# EAGLE design Imager Mainboard (EAGLE 7.7.0)
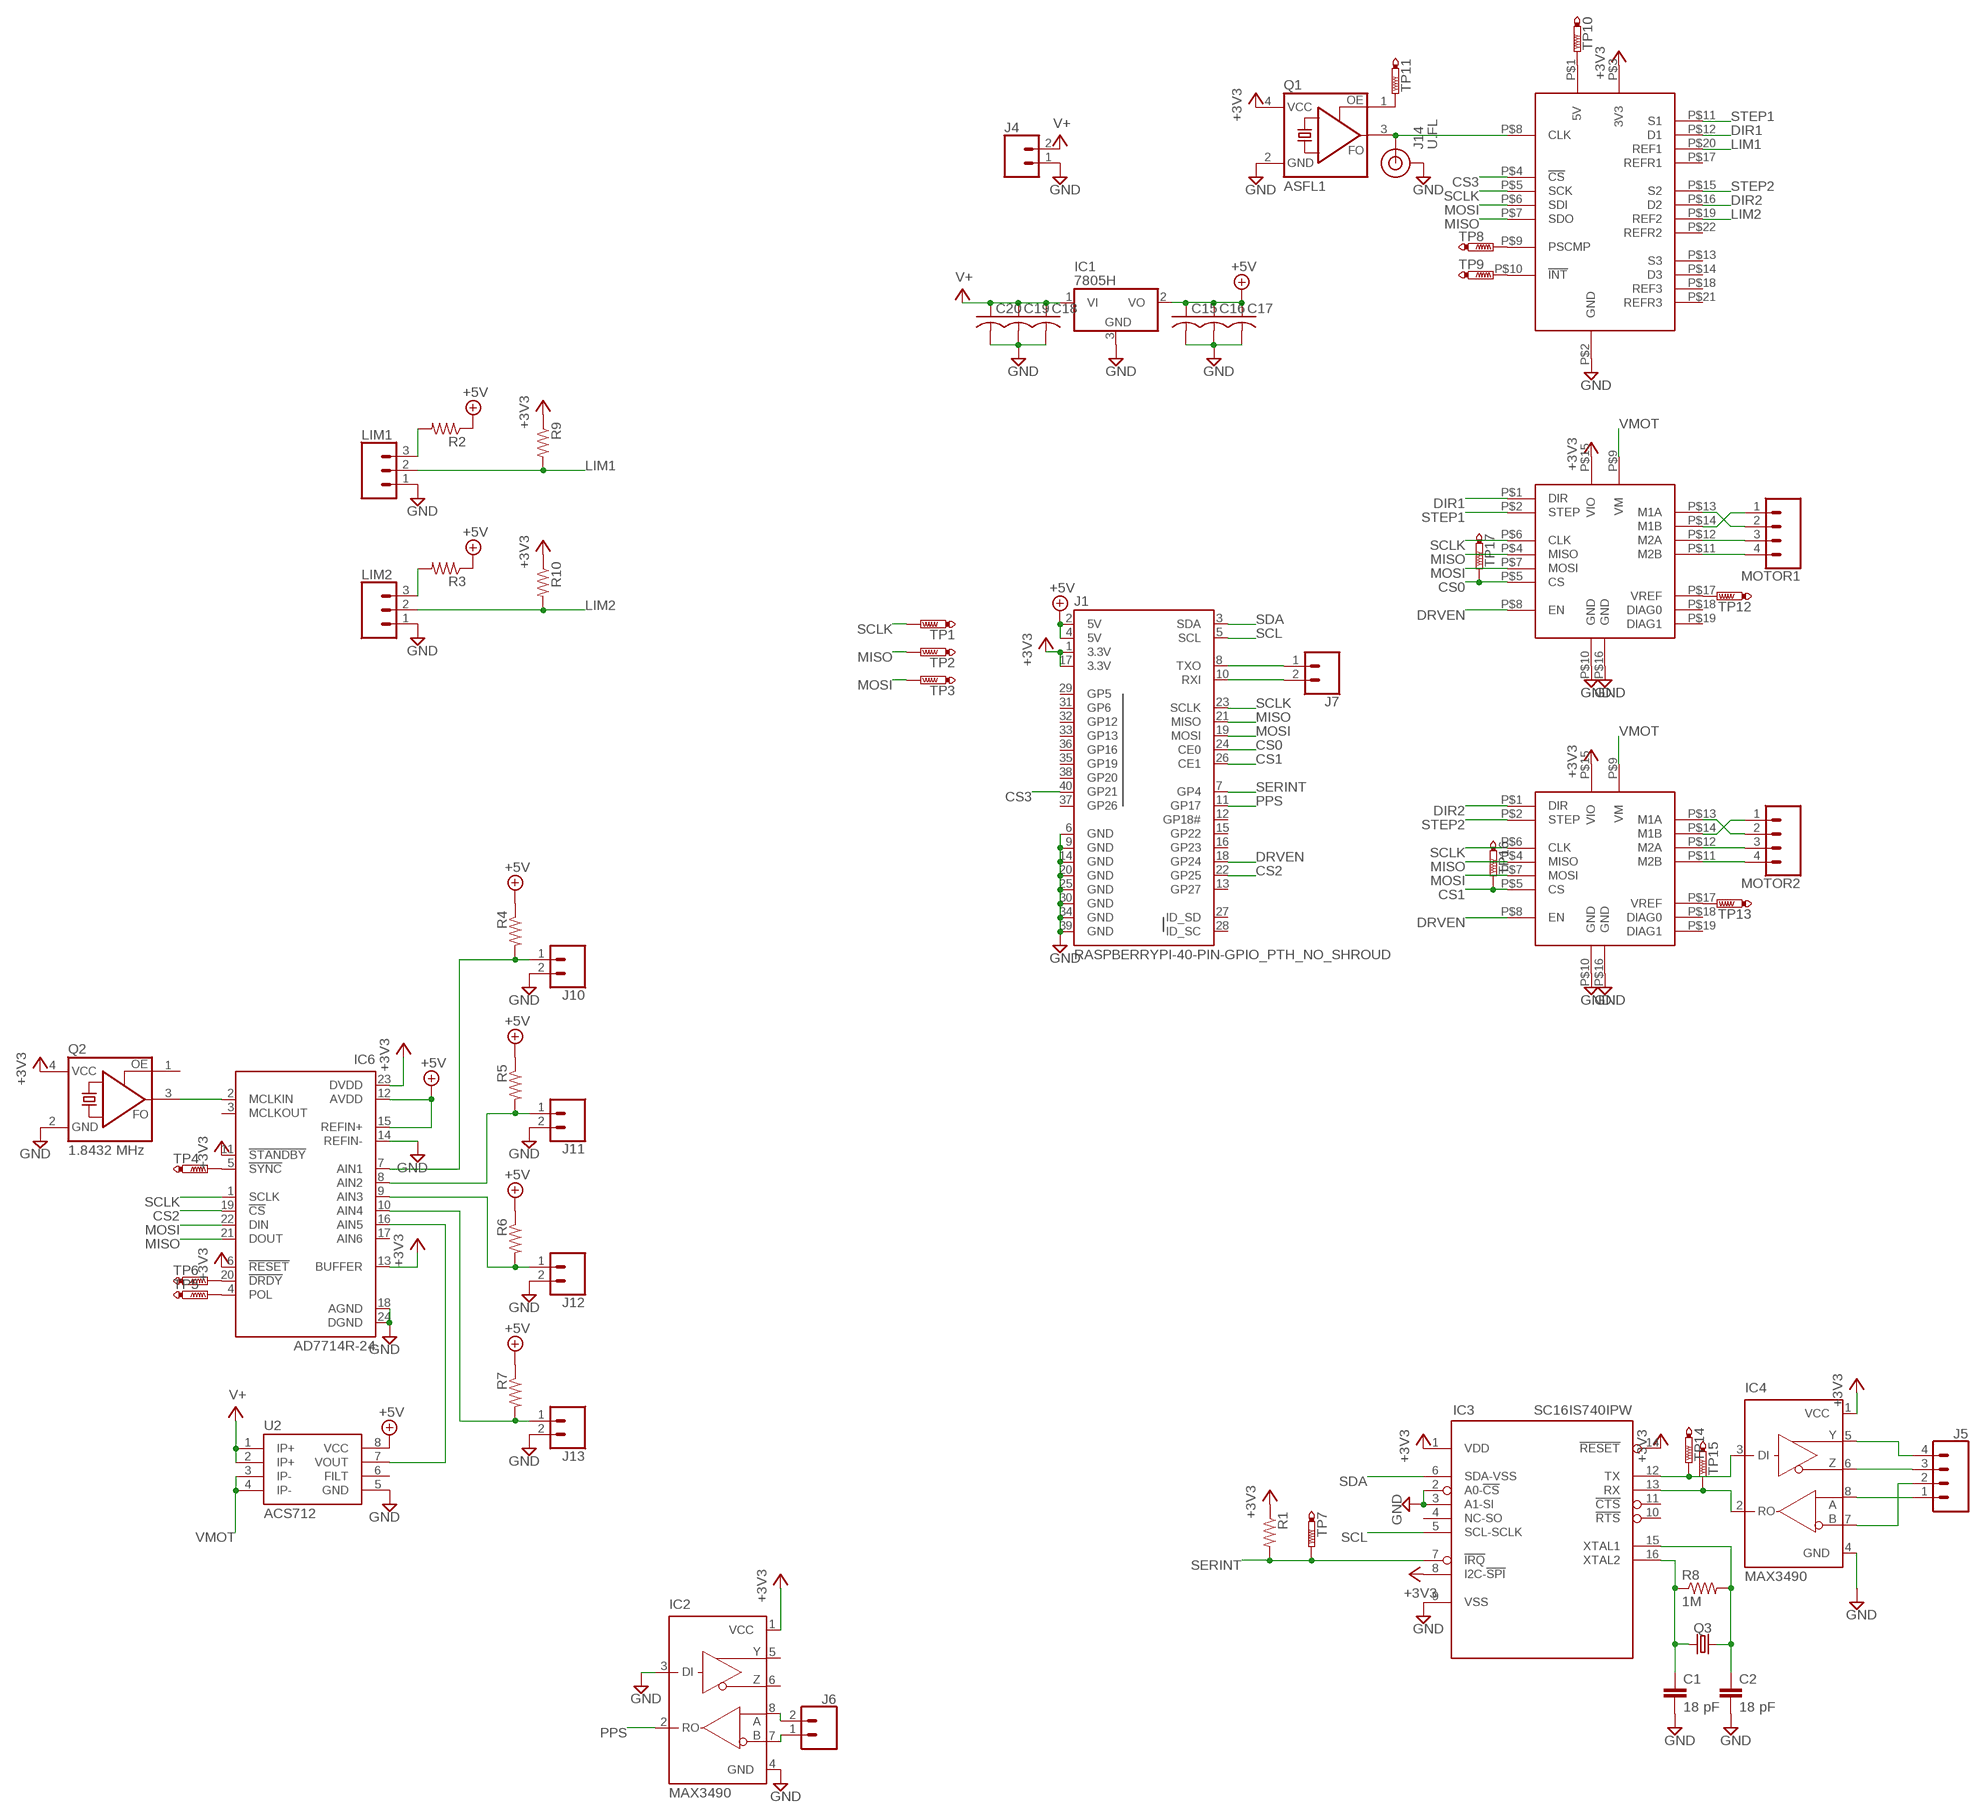
[diagram p0: schematic, sheet 1]

## Parts
C1  18 pF  C-EUC1206  [C1206]
C2  18 pF  C-EUC1206  [C1206]
C15  C-USC1206  [C1206]
C16  C-USC1206  [C1206]
C17  C-USC1206  [C1206]
C18  C-USC1206  [C1206]
C19  C-USC1206  [C1206]
C20  C-USC1206  [C1206]
DRV1  SILENTSTEPSTICK  [SILENTSTEPSTICK]
DRV2  SILENTSTEPSTICK  [SILENTSTEPSTICK]
IC1  7805H  [TO39]
IC2  MAX3490  MAX3467CPA  [SO08]
IC3  SC16IS740IPW  [TSSOP16L]
IC4  MAX3490  MAX3467CPA  [SO08]
IC6  AD7714R-24  [SO24R]
J1  RASPBERRYPI-40-PIN-GPIO_PTH_NO_SHROUD  [2X20]
J4  CONN_02  [1X02]
J5  CONN_04  [1X04]
J6  CONN_02  [1X02]
J7  CONN_02  [1X02]
J10  CONN_02  [1X02]
J11  CONN_02  [1X02]
J12  CONN_02  [1X02]
J13  CONN_02  [1X02]
J14  U.FL  U.FL2PIN  [U.FL]
LIM1  CONN_03  [1X03]
LIM2  CONN_03  [1X03]
MOTOR1  CONN_04  [1X04]
MOTOR2  CONN_04  [1X04]
Q1  ASFL1  [ASF]
Q2  1.8432 MHz  ASFL1  [ASF]
Q3  CRYSTALSMD-5X3.2-4PAD  [CRYSTAL-SMD-5X3.2-4PAD]
R1  R-US_R1206  [R1206]
R2  R-US_R1206  [R1206]
R3  R-US_R1206  [R1206]
R4  R-US_R1206  [R1206]
R5  R-US_R1206  [R1206]
R6  R-US_R1206  [R1206]
R7  R-US_R1206  [R1206]
R8  1M  R-US_R1206  [R1206]
R9  R-US_R1206  [R1206]
R10  R-US_R1206  [R1206]
TP1  PTR1PAD1-13  [P1-13]
TP2  PTR1PAD1-13  [P1-13]
TP3  PTR1PAD1-13  [P1-13]
TP4  PTR1B1,27  [B1,27]
TP5  PTR1B1,27  [B1,27]
TP6  PTR1B1,27  [B1,27]
TP7  PTR1B1,27  [B1,27]
TP8  PTR1PAD1-13  [P1-13]
TP9  PTR1PAD1-13  [P1-13]
TP10  PTR1PAD1-13  [P1-13]
TP11  PTR1PAD1-13  [P1-13]
TP12  PTR1PAD1-13  [P1-13]
TP13  PTR1PAD1-13  [P1-13]
TP14  PTR1PAD1-13  [P1-13]
TP15  PTR1PAD1-13  [P1-13]
TP16  PTR1PAD1-13  [P1-13]
TP17  PTR1PAD1-13  [P1-13]
U2  ACS712  [SO08]
U$1  TMC429-BOB  [TMC429-BOB]

## Nets
+3V3: DRV1.P$15(VIO) DRV2.P$15(VIO) IC2.1(VCC) IC3.1(VDD) IC3.8(I2C-!SPI) IC3.14(!RESET) IC4.1(VCC) IC6.6(!RESET) IC6.11(!STANDBY) IC6.13(BUFFER) IC6.23(DVDD) J1.1(3.3V) J1.17(3.3V) Q1.4(VCC) Q2.4(VCC) R1.1 R9.1 R10.1 U$1.P$3(3V3)
+5V: C15.1 C16.1 C17.1 IC1.2(VO) IC6.12(AVDD) IC6.15(REFIN+) J1.2(5V) J1.4(5V) R2.1 R3.1 R4.1 R5.1 R6.1 R7.1 U2.8(VCC)
CS0: DRV1.P$5(CS) J1.24(CE0) TP17.TP
CS1: DRV2.P$5(CS) J1.26(CE1) TP16.TP
CS2: IC6.19(!CS) J1.22(GP25)
CS3: J1.40(GP21) U$1.P$4(!CS)
DIR1: DRV1.P$1(DIR) U$1.P$12(D1)
DIR2: DRV2.P$1(DIR) U$1.P$16(D2)
DRVEN: DRV1.P$8(EN) DRV2.P$8(EN) J1.18(GP24)
GND: C1.2 C2.2 C15.2 C16.2 C17.2 C18.2 C19.2 C20.2 DRV1.P$10(GND) DRV1.P$16(GND) DRV2.P$10(GND) DRV2.P$16(GND) IC1.3(GND) IC2.3(DI) IC2.4(GND) IC3.2(A0-!CS) IC3.3(A1-SI) IC3.9(VSS) IC4.4(GND) IC6.14(REFIN-) IC6.18(AGND) IC6.24(DGND) J1.6(GND) J1.9(GND) J1.14(GND) J1.20(GND) J1.25(GND) J1.30(GND) J1.34(GND) J1.39(GND) J4.1 J10.2 J11.2 J12.2 J13.2 J14.1(GND) J14.2(GND) LIM1.1 LIM2.1 Q1.2(GND) Q2.2(GND) U2.5(GND) U$1.P$2(GND)
LIM1: LIM1.2 R9.2 U$1.P$20(REF1)
LIM2: LIM2.2 R10.2 U$1.P$19(REF2)
MISO: DRV1.P$4(MISO) DRV2.P$4(MISO) IC6.21(DOUT) J1.21(MISO) TP2.TP U$1.P$7(SDO)
MOSI: DRV1.P$7(MOSI) DRV2.P$7(MOSI) IC6.22(DIN) J1.19(MOSI) TP3.TP U$1.P$6(SDI)
N$1: DRV2.P$14(M1B) MOTOR2.1
N$2: DRV2.P$13(M1A) MOTOR2.2
N$3: IC3.12(TX) IC4.3(DI) TP14.TP
N$4: DRV2.P$12(M2A) MOTOR2.3
N$5: DRV2.P$11(M2B) MOTOR2.4
N$6: DRV1.P$14(M1B) MOTOR1.1
N$7: DRV1.P$13(M1A) MOTOR1.2
N$8: DRV1.P$12(M2A) MOTOR1.3
N$9: DRV1.P$11(M2B) MOTOR1.4
N$10: J1.8(TXO) J7.1
N$11: J1.10(RXI) J7.2
N$12: IC6.2(MCLKIN) Q2.3(FO)
N$13: IC6.5(!SYNC) TP4.TP
N$14: LIM1.3 R2.2
N$15: J14.FEED(SIGNAL) Q1.3(FO) U$1.P$8(CLK)
N$16: LIM2.3 R3.2
N$17: IC6.4(POL) TP5.TP
N$18: IC6.16(AIN5) U2.7(VOUT)
N$19: IC6.20(!DRDY) TP6.TP
N$20: IC6.7(AIN1) J10.1 R4.2
N$21: TP8.TP U$1.P$9(PSCMP)
N$22: IC6.8(AIN2) J11.1 R5.2
N$23: IC6.9(AIN3) J12.1 R6.2
N$24: IC6.10(AIN4) J13.1 R7.2
N$25: TP9.TP U$1.P$10(!INT)
N$26: TP10.TP U$1.P$1(5V)
N$27: Q1.1(OE) TP11.TP
N$28: DRV1.P$17(VREF) TP12.TP
N$29: DRV2.P$17(VREF) TP13.TP
N$30: C2.1 IC3.15(XTAL1) Q3.3 R8.2
N$31: C1.1 IC3.16(XTAL2) Q3.1 R8.1
N$37: IC3.13(RX) IC4.2(RO) TP15.TP
N$38: IC4.6(Z) J5.3
N$39: IC4.8(A) J5.1
N$40: IC4.7(B) J5.2
N$41: IC4.5(Y) J5.4
N$43: IC2.7(B) J6.1
N$44: IC2.8(A) J6.2
PPS: IC2.2(RO) J1.11(GP17)
SCL: IC3.5(SCL-SCLK) J1.5(SCL)
SCLK: DRV1.P$6(CLK) DRV2.P$6(CLK) IC6.1(SCLK) J1.23(SCLK) TP1.TP U$1.P$5(SCK)
SDA: IC3.6(SDA-VSS) J1.3(SDA)
SERINT: IC3.7(!IRQ) J1.7(GP4) R1.2 TP7.TP
STEP1: DRV1.P$2(STEP) U$1.P$11(S1)
STEP2: DRV2.P$2(STEP) U$1.P$15(S2)
V+: C18.1 C19.1 C20.1 IC1.1(VI) J4.2 U2.1(IP+) U2.2(IP+)
VMOT: DRV1.P$9(VM) DRV2.P$9(VM) U2.3(IP-) U2.4(IP-)
Unconnected: DRV1.P$18(DIAG0) DRV1.P$19(DIAG1) DRV2.P$18(DIAG0) DRV2.P$19(DIAG1) IC2.5(Y) IC2.6(Z) IC3.4(NC-SO) IC3.10(!RTS) IC3.11(!CTS) IC6.3(MCLKOUT) IC6.17(AIN6) J1.12(GP18#) J1.13(GP27) J1.15(GP22) J1.16(GP23) J1.27(ID_SD) J1.28(ID_SC) J1.29(GP5) J1.31(GP6) J1.32(GP12) J1.33(GP13) J1.35(GP19) J1.36(GP16) J1.37(GP26) J1.38(GP20) Q2.1(OE) U2.6(FILT) U$1.P$13(S3) U$1.P$14(D3) U$1.P$17(REFR1) U$1.P$18(REF3) U$1.P$21(REFR3) U$1.P$22(REFR2)

## Library data of the parts
C1 C2 = resistor:C-EU: CAPACITOR, European symbol
C15-C20 = resistor:C-US: CAPACITOR, American symbol
DRV1 DRV2 = FRC696:SILENTSTEPSTICK
IC1 = linear:78*: Positive VOLTAGE REGULATOR Source: http://cache.national.com/ds/LM/LM78L05.pdf http://www.fairchildsemi.com/ds/LM/LM7805.pdf
IC2 IC4 = maxim:MAX3467*: +5V, Fail-Safe, 40Mbps, Profibus RS-485/RS-422 Transceivers Source: MAX3465-MAX3469.pdf; OC_FARNELL: unknown; OC_NEWARK: unknown
IC3 = FRC696:SC16IS740: SPI/I2C/IrDA to UART
IC6 = analog-devices:AD7714: Signal Conditioning ADC 3 V/5 V, CMOS, 500 mA Source: http://www.analog.com/UploadedFiles/Data_Sheets/39677768AD7714_c.pdf; OC_FARNELL: unknown; OC_NEWARK: unknown
J1 = SparkFun-Connectors:RASPBERRYPI-40-PIN-GPIO: Raspberry Pi GPIO Header 2x20 pin connector, as found on B, B+, A+ models. Both shrouded PTH and SMT versions available. SparkFun Products: GPIO Shrouded Header <https://www.sparkfun.com/products/13054>- PTH SparkFun Pi Wedge (Preassembled) <https://www.sparkfun.com/products/13717>
J4 J6 J7 J10-J13 = SparkFun-Connectors:CONN_02: Multi connection point. Often used as Generic Header-pin footprint for 0.1 inch spaced/style header connections On any of the 0.1 inch spaced packages, you can populate with these: Break Away Headers - Straight <https://www.sparkfun.com/products/116> (PRT-00116) Break Away Male Headers - Right Angle <https://www.sparkfun.com/products/553> (PRT-00553) Female Headers <https://www.sparkfun.com/products/115> (PRT-00115) Break Away Headers - Machine Pin <https://www.sparkfun.com/products/117> (PRT-00117) Break Away Female Headers - Swiss Machine Pin <https://www.sparkfun.com/products/743> (PRT-00743) For SCREWTERMINALS and SPRING TERMINALS visit here: Screw Terimnals on SparkFun.com <https://www.sparkfun.com/search/results?term=Screw+Terminals> (5mm/3.5mm/2.54mm spacing) This device is also useful as a general connection point to wire up your design to another part of your project. Our various solder wires solder well into these plated through hole pads. Hook-Up Wire - Assortment (Stranded, 22 AWG) <https://www.sparkfun.com/products/11375> (PRT-11375) Hook-Up Wire - Assortment (Solid Core, 22 AWG) <https://www.sparkfun.com/products/11367> (PRT-11367) View the entire wire category on our website here <https://www.sparkfun.com/categories/141> Special notes: Molex polarized connector foot print use with: PRT-08233 with associated crimp pins and housings. 2.54_SCREWTERM for use with PRT-10571. 3.5mm Screw Terminal footprints for PRT-08084 5mm Screw Terminal footprints for use with PRT-08432
J5 MOTOR1 MOTOR2 = SparkFun-Connectors:CONN_04: Multi connection point. Often used as Generic Header-pin footprint for 0.1 inch spaced/style header connections On any of the 0.1 inch spaced packages, you can populate with these: Break Away Headers - Straight <https://www.sparkfun.com/products/116> (PRT-00116) Break Away Male Headers - Right Angle <https://www.sparkfun.com/products/553> (PRT-00553) Female Headers <https://www.sparkfun.com/products/115> (PRT-00115) Break Away Headers - Machine Pin <https://www.sparkfun.com/products/117> (PRT-00117) Break Away Female Headers - Swiss Machine Pin <https://www.sparkfun.com/products/743> (PRT-00743) For SCREWTERMINALS and SPRING TERMINALS visit here: Screw Terimnals on SparkFun.com <https://www.sparkfun.com/search/results?term=Screw+Terminals> (5mm/3.5mm/2.54mm spacing) This device is also useful as a general connection point to wire up your design to another part of your project. Our various solder wires solder well into these plated through hole pads. Hook-Up Wire - Assortment (Stranded, 22 AWG) <https://www.sparkfun.com/products/11375> (PRT-11375) Hook-Up Wire - Assortment (Solid Core, 22 AWG) <https://www.sparkfun.com/products/11367> (PRT-11367) View the entire wire category on our website here <https://www.sparkfun.com/categories/141> Special notes: Molex polarized connector foot print use with SKU : PRT-08231 with associated crimp pins and housings. 1MM SMD Version SKU: PRT-10208; PROD_ID: CONN-09696
J14 = SparkFun-Connectors:U.FL2PIN: SMD Antenna Connector - U.FL 2mm height, 3.0mm x 3.0mm receptacle size. SparkFun Products: SparkFun WiFi Shield - ESP8266 <https://www.sparkfun.com/products/13287> SparkFun ESP8266 Thing <https://www.sparkfun.com/products/13231> SparkFun MiniGen - Pro Mini Signal Generator Shield <https://www.sparkfun.com/products/11420>; PROD_ID: CONN-09193; SF_ID: WRL-09144
LIM1 LIM2 = SparkFun-Connectors:CONN_03: Multi connection point. Often used as Generic Header-pin footprint for 0.1 inch spaced/style header connections On any of the 0.1 inch spaced packages, you can populate with these: Break Away Headers - Straight <https://www.sparkfun.com/products/116> (PRT-00116) Break Away Male Headers - Right Angle <https://www.sparkfun.com/products/553> (PRT-00553) Female Headers <https://www.sparkfun.com/products/115> (PRT-00115) Break Away Headers - Machine Pin <https://www.sparkfun.com/products/117> (PRT-00117) Break Away Female Headers - Swiss Machine Pin <https://www.sparkfun.com/products/743> (PRT-00743) Stackable Header - 3 Pin (Female, 0.1") <https://www.sparkfun.com/products/13875> (PRT-13875) For SCREWTERMINALS and SPRING TERMINALS visit here: Screw Terimnals on SparkFun.com <https://www.sparkfun.com/search/results?term=Screw+Terminals> (5mm/3.5mm/2.54mm spacing) This device is also useful as a general connection point to wire up your design to another part of your project. Our various solder wires solder well into these plated through hole pads. Hook-Up Wire - Assortment (Stranded, 22 AWG) <https://www.sparkfun.com/products/11375> (PRT-11375) Hook-Up Wire - Assortment (Solid Core, 22 AWG) <https://www.sparkfun.com/products/11367> (PRT-11367) View the entire wire category on our website here <https://www.sparkfun.com/categories/141> Special notes: Molex polarized connector foot print use with SKU : PRT-08232 with associated crimp pins and housings.
Q1 Q2 = crystal:ASF*: CRYSTAL CLOCK OSCILLATORS 5.0 Vdc or 3.3 Vdc - LOW PROFILE ULTRA MINIATURE CERAMIC SURFACE MOUNT Source: http://www.abracon.com/Oscillators/asf1-L-L1.pdf; MF: Abracon Corporation; MPN: ASFL1-125.000MHZ-EC-T; OC_FARNELL: 1838931; OC_NEWARK: 19M1882
Q3 = SparkFun-Clocks:CRYSTAL: Crystals (Generic) These are passive quartz crystals, which can be used as a clock source for a microcontroller. Crystal's are two-terminal devices. They require external "load" capacitors to generate an oscillating signal.
R1-R10 = resistor:R-US_: RESISTOR, American symbol
TP1-TP17 = testpad:PTR1: TEST PIN
U2 = SparkFun-Sensors:ACS712: ACS712 Hall-effect-based isolated linear current sensor Datasheet <http://www.sparkfun.com/datasheets/BreakoutBoards/0712.pdf> SparkFun Products SparkFun Low Current Sensor Breakout - ACS712 <https://www.sparkfun.com/products/8883> (SEN-08883); PROD_ID: IC-08964
U$1 = FRC696:TMC429-BOB

## Board
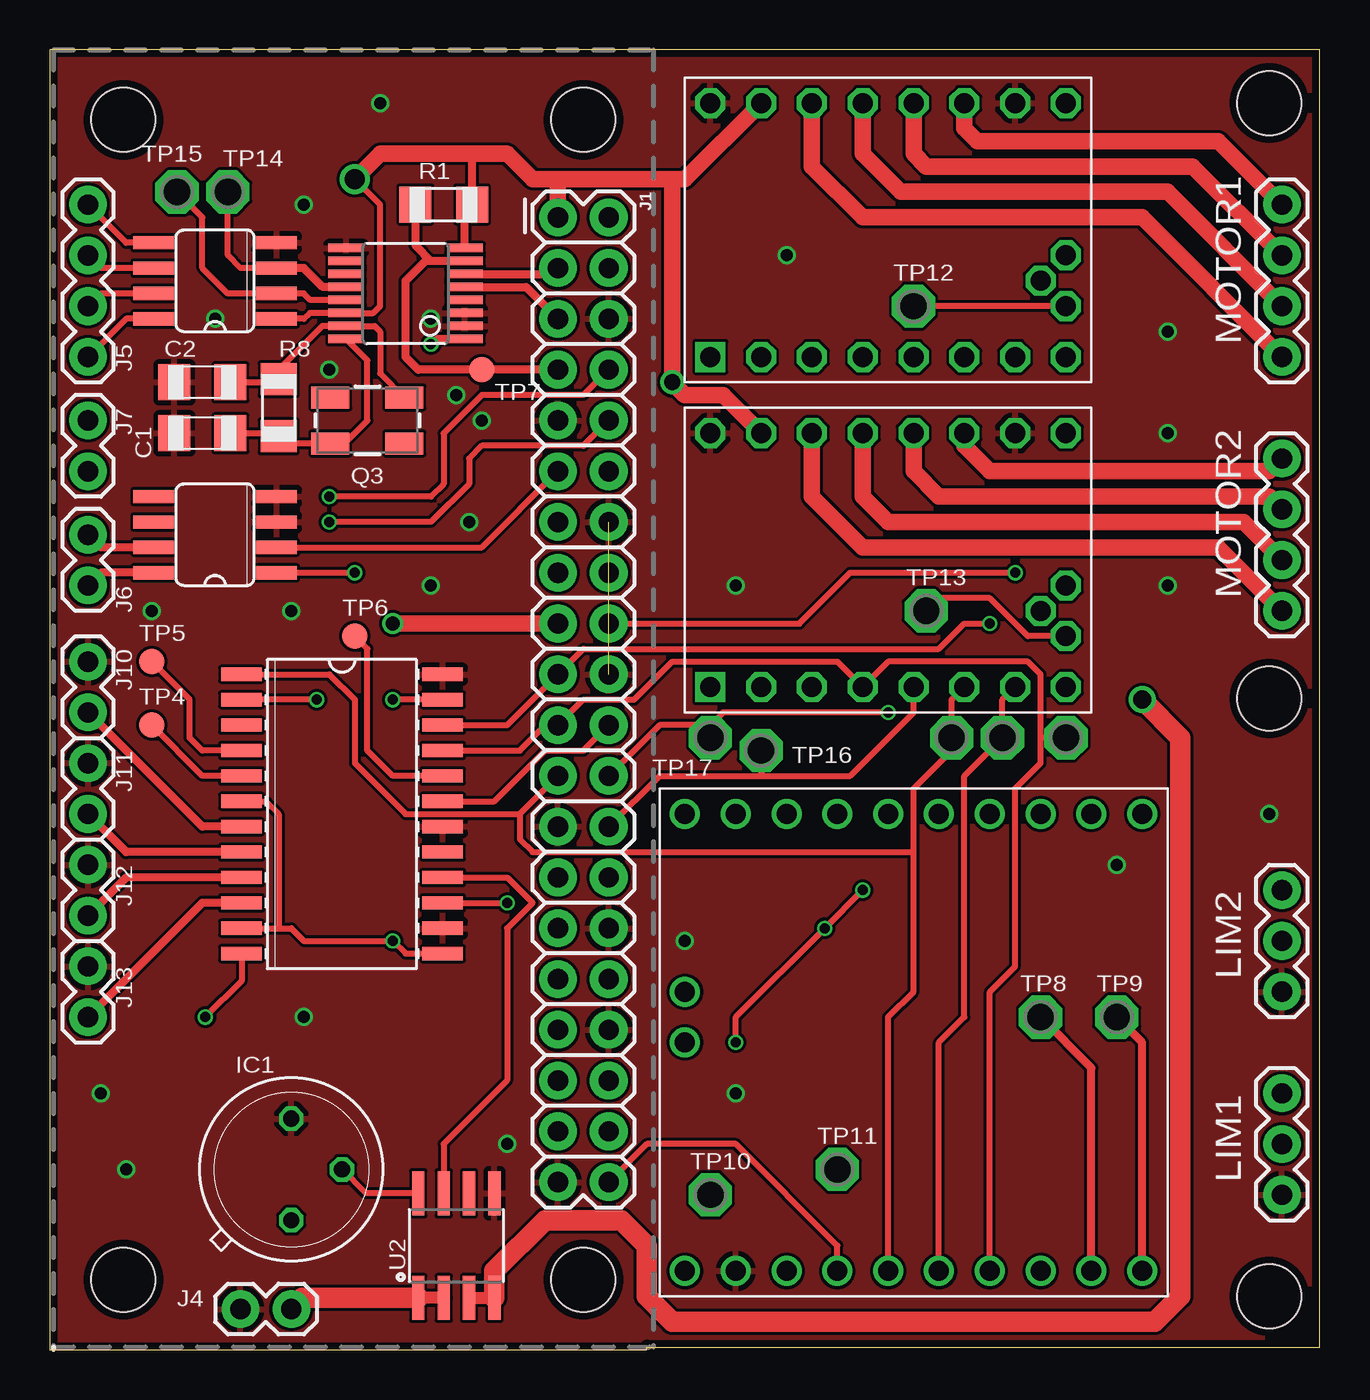
[diagram p1: board, top side]
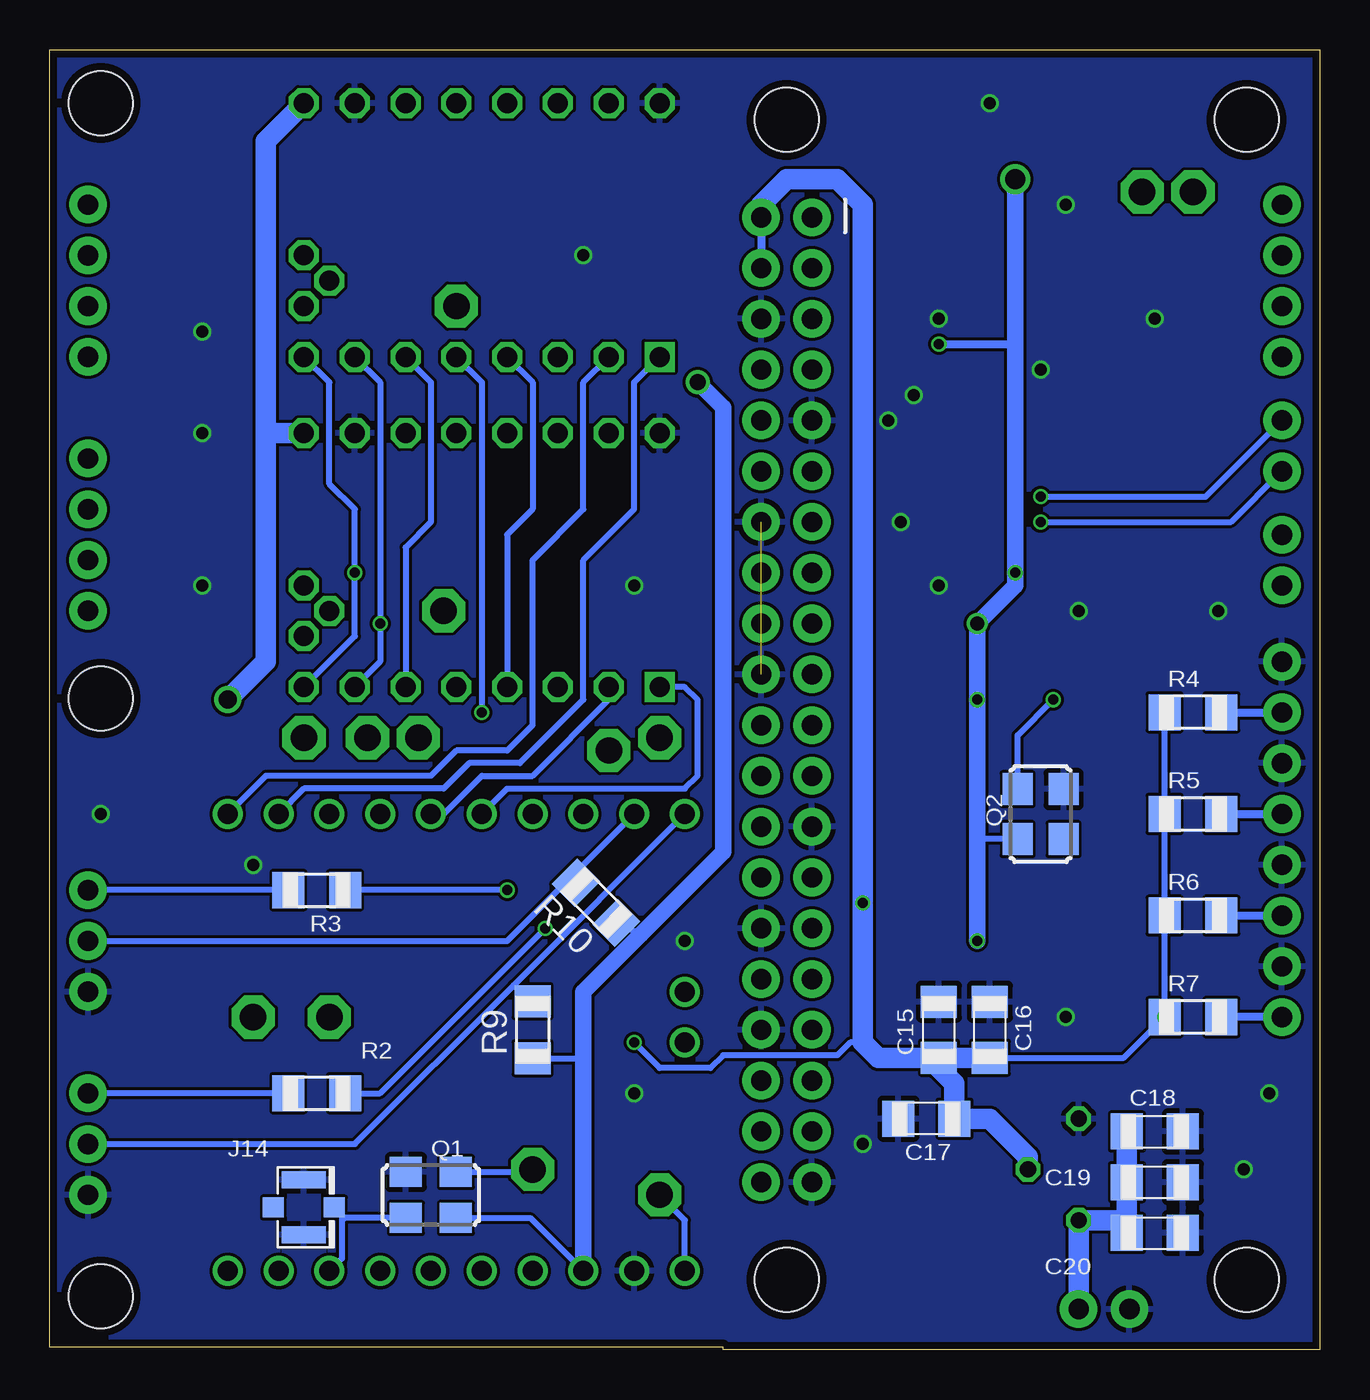
[diagram p2: board, bottom side, seen from below]

Size 63.5 x 65 mm. Coordinates in mm from the lower left corner, seen from the top.
Outline: 0,0 29.84,0 29.84,0.12 63.5,0.12 63.5,65 0,65 0,0
Copper layers (1*16): Top 0.035559375mm / dielectric 1.6mm / Bottom 0.035559375mm
Design rules "oshpark-2layer": minimum track width 6mil, minimum drill 10mil, track to track 6mil, track to pad 6mil, pad to pad 6mil, via to via 6mil, smd to smd 6mil, copper to edge 15mil, drill to drill 6mil, minimum pad ring 5mil, minimum via ring 5mil, stop-mask expansion 2.5mil, vias tented up to drill 0mil, thermal gap 10mil
Holes 3.2 mm at 3.67,61.5 26.67,61.5 26.67,3.5 3.67,3.5 60.96,2.66 60.96,62.35 60.96,32.56

### Footprints (pad centres in the part's own frame; a part is rotated, then mirrored left to right if it is on the bottom)
C1206 = smd 1.6 x 1.8: 1 -1.4,0; 2 1.4,0
SILENTSTEPSTICK = drill 1 square: P$1 -6.35,7.62 | drill 1 octagon: P$2 -6.35,5.08; P$3 -6.35,2.54; P$4 -6.35,0; P$5 -6.35,-2.54; P$6 -6.35,-5.08; P$7 -6.35,-7.62; P$8 -6.35,-10.16; P$9 6.35,-10.16; P$10 6.35,-7.62; P$11 6.35,-5.08; P$12 6.35,-2.54; P$13 6.35,0; P$14 6.35,2.54; P$15 6.35,5.08; P$16 6.35,7.62; P$17 -3.81,-10.16; P$18 -2.54,-8.89; P$19 -1.27,-10.16
TO39 = drill 0.813 octagon: 1 0,-2.54; 2 2.54,0; 3 0,2.54
SO08 = smd 0.66 x 2.032: 1 -1.905,-3.073; 2 -0.635,-3.073; 3 0.635,-3.073; 4 1.905,-3.073; 5 1.905,3.073; 6 0.635,3.073; 7 -0.635,3.073; 8 -1.905,3.073
TSSOP16L = smd 0.42 x 1.78: 1 -2.275,-2.97; 2 -1.625,-2.97; 3 -0.975,-2.97; 4 -0.325,-2.97; 5 0.325,-2.97; 6 0.975,-2.97; 7 1.625,-2.97; 8 2.275,-2.97; 9 2.275,2.97; 10 1.625,2.97; 11 0.975,2.97; 12 0.325,2.97; 13 -0.325,2.97; 14 -0.975,2.97; 15 -1.625,2.97; 16 -2.275,2.97
SO24R = smd 0.66 x 2.032: 1 -6.985,-5.029; 2 -5.715,-5.029; 3 -4.445,-5.029; 4 -3.175,-5.029; 5 -1.905,-5.029; 6 -0.635,-5.029; 7 0.635,-5.029; 8 1.905,-5.029; 9 3.175,-5.029; 10 4.445,-5.029; 11 5.715,-5.029; 12 6.985,-5.029; 13 6.985,5.029; 14 5.715,5.029; 15 4.445,5.029; 16 3.175,5.029; 17 1.905,5.029; 18 0.635,5.029; 19 -0.635,5.029; 20 -1.905,5.029; 21 -3.175,5.029; 22 -4.445,5.029; 23 -5.715,5.029; 24 -6.985,5.029
2X20 = drill 1.016 pad 1.88: 1 0,0; 2 0,2.54; 3 2.54,0; 4 2.54,2.54; 5 5.08,0; 6 5.08,2.54; 7 7.62,0; 8 7.62,2.54; 9 10.16,0; 10 10.16,2.54; 11 12.7,0; 12 12.7,2.54; 13 15.24,0; 14 15.24,2.54; 15 17.78,0; 16 17.78,2.54; 17 20.32,0; 18 20.32,2.54; 19 22.86,0; 20 22.86,2.54; 21 25.4,0; 22 25.4,2.54; 23 27.94,0; 24 27.94,2.54; 25 30.48,0; 26 30.48,2.54; 27 33.02,0; 28 33.02,2.54; 29 35.56,0; 30 35.56,2.54; 31 38.1,0; 32 38.1,2.54; 33 40.64,0; 34 40.64,2.54; 35 43.18,0; 36 43.18,2.54; 37 45.72,0; 38 45.72,2.54; 39 48.26,0; 40 48.26,2.54
1X02 = drill 1.016 pad 1.88: 1 0,0; 2 2.54,0
1X04 = drill 1.016 pad 1.88: 1 0,0; 2 2.54,0; 3 5.08,0; 4 7.62,0
U.FL = smd 2.2 x 0.85: 1 0,1.375; 2 0,-1.375 | smd 1.05 x 1: FEED 1.525,0; NC -1.525,0
1X03 = drill 1.016 pad 1.88: 1 0,0; 2 2.54,0; 3 5.08,0
ASF = smd 1.6 x 1.5: 1 -1.25,-1.15; 2 1.25,-1.15; 3 1.25,1.15; 4 -1.25,1.15
CRYSTAL-SMD-5X3.2-4PAD = smd 1.9 x 1.1: 1 -1.85,-1.15; 2 1.85,-1.15; 3 1.85,1.15; 4 -1.85,1.15
R1206 = smd 1.6 x 1.803: 1 -1.422,0; 2 1.422,0
P1-13 = drill 1.321 pad 2.159 octagon: TP 0,0
B1,27 = smd 1.27 x 1.27: TP 0,0
SO08' = smd 0.61 x 2.21: 1 -1.905,-2.616; 2 -0.635,-2.616; 3 0.635,-2.616; 4 1.905,-2.616; 5 1.905,2.616; 6 0.635,2.616; 7 -0.635,2.616; 8 -1.905,2.616
TMC429-BOB = drill 1: P$1 -11.43,10.16; P$2 -11.43,7.62; P$3 -11.43,5.08; P$4 -11.43,2.54; P$5 -11.43,0; P$6 -11.43,-2.54; P$7 -11.43,-5.08; P$8 -11.43,-7.62; P$9 -11.43,-10.16; P$10 -11.43,-12.7; P$11 11.43,-12.7; P$12 11.43,-10.16; P$13 11.43,-7.62; P$14 11.43,-5.08; P$15 11.43,-2.54; P$16 11.43,0; P$17 11.43,2.54; P$18 11.43,5.08; P$19 11.43,7.62; P$20 11.43,10.16; P$21 2.54,10.16; P$22 0,10.16

### Placement (x,y rotation side)
C1  7.62,45.84 180 top
C2  7.62,48.38 180 top
C15  19.05,15.99 90 bottom
C16  16.51,15.99 90 bottom
C17  19.68,11.55 180 bottom
C18  8.26,10.91 0 bottom
C19  8.26,8.37 0 bottom
C20  8.26,5.83 0 bottom
DRV1  40.64,56 90 top
DRV2  40.64,39.49 90 top
IC1  12.06,9.01 0 top
IC2  8.26,40.76 90 top
IC3  17.78,52.82 90 top
IC4  8.26,53.46 90 top
IC6  14.61,26.79 270 top
J1  25.4,56.63 270 top
J4  9.53,2.02 0 top
J5  1.91,49.65 90 top
J6  1.91,40.76 270 top
J7  1.91,46.47 270 top
J10  1.91,31.87 90 top
J11  1.91,26.79 90 top
J12  1.91,21.71 90 top
J13  1.91,16.63 90 top
J14  50.8,7.1 0 bottom
LIM1  61.59,7.74 90 top
LIM2  61.59,17.9 90 top
MOTOR1  61.59,49.65 90 top
MOTOR2  61.59,36.95 90 top
Q1  44.45,7.74 180 bottom
Q2  13.97,26.79 90 bottom
Q3  15.88,46.47 0 top
R1  19.68,57.27 180 top
R2  50.16,12.82 180 bottom
R3  50.16,22.98 180 bottom
R4  6.35,31.87 0 bottom
R5  6.35,26.79 0 bottom
R6  6.35,21.71 0 bottom
R7  6.35,16.63 0 bottom
R8  11.43,47.11 90 top
R9  39.37,15.99 90 bottom
R10  36.2,22.34 135 bottom
TP1  45.09,30.6 0 top
TP2  50.8,30.6 0 top
TP3  47.62,30.6 0 top
TP4  5.08,31.23 0 top
TP5  5.08,34.41 0 top
TP6  15.24,35.68 0 top
TP7  21.59,49.01 0 top
TP8  49.53,16.63 0 top
TP9  53.34,16.63 0 top
TP10  33.02,7.74 0 top
TP11  39.37,9.01 0 top
TP12  43.18,52.19 0 top
TP13  43.81,36.95 0 top
TP14  8.89,57.9 0 top
TP15  6.35,57.9 0 top
TP16  35.56,29.96 0 top
TP17  33.02,30.6 0 top
U2  ACS712  [SO08']  20.32,5.2 0 top
U$1  41.91,15.36 90 top

### Tracks (layer width: path | path; a pad name or v marks a point on that pad's centre or on a via)
+3V3  (via drill 0.5, 0.7, 0.8, 1)
  Top 0.305: IC6.11 11.43,21.07 | 11.43,21.07 12.06,21.07 12.7,20.44 v17.14,20.44 17.78,19.8 IC6.13 | IC6.6 10.79,27.42 11.43,26.79 11.43,21.07 | IC4.1 12.7,51.55 12.99,51.85 IC3.14 16.17,51.85 16.51,52.19 16.51,57.27 v15.24,58.54 | IC2.1 v15.24,38.85 | IC6.23 v17.14,32.5
  Top 0.406: 20.95,59.81 21.11,59.65 R1.1 20.75,56.91 IC3.8 | IC3.1 19.42,50.55 v19.05,50.28
  Top 0.813: J1.1 25.4,58.54 | 25.4,58.54 31.11,58.54 | 31.11,58.54 31.75,58.54 DRV1.P$15 | DRV2.P$15 33.66,47.74 31.75,47.74 v31.11,48.38 31.11,58.54 | 25.4,58.54 24.13,58.54 22.86,59.81 20.95,59.81 16.51,59.81 v15.24,58.54 | J1.17 v17.14,36.31
  Bottom 0.305: Q1.4 39.49,6.59 U$1.P$3 | Q2.4 17.12,25.54 17.14,25.52 | R9.1 36.98,14.57 36.83,14.72 | R10.1 33.97,20.75
  Bottom 0.406: v19.05,50.28 15.24,50.28
  Bottom 0.813: v15.24,58.54 15.24,50.28 v15.24,38.85 15.24,38.22 v17.14,36.31 v17.14,32.5 17.14,25.52 v17.14,20.44 | v31.11,48.38 29.84,47.11 29.84,24.88 33.97,20.75 36.83,17.9 36.83,14.72 U$1.P$3
+5V  (via drill 0.5)
  Top 0.305: IC6.15 v22.86,22.34 | IC6.12 9.58,18.43 R7.1 | U2.8 15.8,7.81 IC1.2 | v34.29,15.36 34.29,16.63 v38.73,21.07 v40.64,22.98
  Bottom 0.305: C16.1 9.81,14.59 R7.1 R6.1 R5.1 R4.1 | 22.86,15.36 23.5,15.36 24.13,14.72 29.84,14.72 30.48,14.09 33.02,14.09 v34.29,15.36 | v40.64,22.98 R3.1 | R2.1 46.99,12.82 v38.73,21.07 | 18.55,14.59 C15.1
  Bottom 0.406: J1.2 J1.4
  Bottom 1.016: IC1.2 14.61,9.64 16.51,11.55 C17.1 18.29,13.32 19.05,14.09 18.55,14.59 C16.1 | C15.1 22.09,14.59 22.86,15.36 v22.86,22.34 22.86,57.27 24.13,58.54 26.67,58.54 27.94,57.27 J1.2
  other vias: 7.77,16.63
CS0  (via drill 0.5)
  Top 0.305: v41.91,31.87 33.66,31.87 33.02,31.23 | 33.02,31.23 30.48,31.23 J1.24 | TP17.TP 33.02,31.23
  Bottom 0.305: DRV1.P$5 41.91,48.38 v41.91,31.87
CS1
  Top 0.305: J1.26 30.48,28.69 35.56,28.69 | 35.56,28.69 40.01,28.69 43.18,31.87 DRV2.P$5 | TP16.TP 35.56,28.69
CS2
  Top 0.305: IC6.19 22.23,27.42 24.77,29.96 26.67,29.96 J1.22
CS3
  Top 0.305: U$1.P$4 39.37,5.2 34.29,10.28 29.84,10.28 J1.40
DIR1
  Bottom 0.305: DRV1.P$1 34.29,48.38 34.29,42.03 36.83,39.49 36.83,32.5 40.01,29.33 42.55,29.33 43.81,28.06 50.8,28.06 U$1.P$12
DIR2
  Bottom 0.305: U$1.P$16 40.64,28.06 31.75,28.06 31.11,28.69 31.11,32.5 31.75,33.14 DRV2.P$1
DRVEN  (via drill 0.5)
  Top 0.305: J1.18 37.47,36.31 40.01,38.85 v48.26,38.85
  Bottom 0.305: DRV2.P$8 48.26,35.68 v48.26,38.85 48.26,42.03 49.53,43.3 49.53,48.38 DRV1.P$8
GND  (via drill 0.6)  (1 unrouted)
  other vias: 12.7,57.27 16.51,62.35 19.05,38.22 34.29,38.22 36.83,54.73 55.88,50.92 55.88,45.84 55.88,38.22 60.96,26.79 53.34,24.25 31.75,20.44 2.54,12.82 3.81,9.01 12.7,16.63 22.86,10.28 34.29,12.82 19.05,51.55 12.06,36.95 5.08,36.95 8.26,51.55 21.59,46.47 13.97,49.01 20.32,47.74 20.95,41.39
  pour Bottom: -21.59,68.7 80.01,68.7 80.01,-1.15 -21.59,-1.15
  pour Top: -10.16,72.51 72.39,72.51 72.39,-10.04 -10.16,-10.04
LIM1
  Bottom 0.305: LIM1.2 48.26,10.28 40.32,18.21 | 40.32,18.21 U$1.P$20 | R9.2 39.52,17.41 40.32,18.21
LIM2
  Bottom 0.305: LIM2.2 40.64,20.44 37.15,23.93 | 37.15,23.93 U$1.P$19 | R10.2 37.15,23.93
MISO
  Top 0.305: U$1.P$7 46.99,17.9 48.26,19.17 48.26,28.06 49.53,29.33 49.53,30.6 | 49.53,30.6 49.53,33.77 48.9,34.41 41.91,34.41 DRV2.P$4 39.37,34.41 31.11,34.41 29.21,32.5 26.67,32.5 J1.21 24.77,31.23 23.5,29.96 IC6.21 | TP2.TP 49.53,30.6
  Bottom 0.305: DRV1.P$4 39.37,48.38 39.37,42.03 40.64,40.76 DRV2.P$4
MOSI  (via drill 0.5)
  Top 0.305: U$1.P$6 44.45,15.36 45.72,16.63 45.72,28.69 TP3.TP 47.62,32.5 DRV2.P$7 | IC6.22 22.86,31.23 J1.19 26.67,35.04 44.45,35.04 45.72,36.31 v46.99,36.31
  Bottom 0.305: DRV1.P$7 46.99,48.38 v46.99,36.31 46.99,34.41 DRV2.P$7
N$1
  Top 0.813: DRV2.P$14 38.1,42.66 40.64,40.12 58.42,40.12 MOTOR2.1
N$2
  Top 0.813: DRV2.P$13 40.64,42.66 41.91,41.39 59.69,41.39 MOTOR2.2
N$3
  Top 0.305: IC4.3 9.53,54.09 8.89,54.73 TP14.TP
  Top 0.406: IC3.12 13.64,53.15 12.7,54.09 IC4.3
N$4
  Top 0.813: DRV2.P$12 43.18,43.93 44.45,42.66 60.96,42.66 MOTOR2.3
N$5
  Top 0.813: DRV2.P$11 45.72,45.2 46.99,43.93 60.96,43.93 MOTOR2.4
N$6
  Top 0.813: DRV1.P$14 38.1,59.17 40.64,56.63 54.61,56.63 MOTOR1.1
N$7
  Top 0.813: DRV1.P$13 40.64,59.81 42.55,57.9 55.88,57.9 MOTOR1.2
N$8
  Top 0.813: DRV1.P$12 43.18,59.81 43.81,59.17 57.15,59.17 MOTOR1.3
N$9
  Top 0.813: DRV1.P$11 45.72,61.08 46.35,60.44 58.42,60.44 MOTOR1.4
N$10  (via drill 0.5)
  Top 0.305: J1.8 26.67,47.74 21.59,47.74 19.68,45.84 19.68,43.3 19.05,42.66 v13.97,42.66
  Bottom 0.305: v13.97,42.66 5.71,42.66 J7.1
N$11  (via drill 0.5)
  Top 0.305: J1.10 26.67,45.2 21.59,45.2 20.95,44.57 20.95,43.3 19.05,41.39 v13.97,41.39
  Bottom 0.305: v13.97,41.39 4.45,41.39 J7.2
N$12  (via drill 0.5)
  Top 0.305: v13.34,32.5 IC6.2
  Bottom 0.305: Q2.3 15.12,30.72 v13.34,32.5
N$13
  Top 0.305: IC6.5 7.62,28.69 TP4.TP
N$14
  Bottom 0.305: R2.2 LIM1.3
N$15
  Bottom 0.305: U$1.P$8 48.9,4.56 48.9,6.47 | 48.9,6.47 48.9,6.72 J14.FEED | Q1.3 48.77,6.59 48.9,6.47
N$16
  Bottom 0.305: R3.2 LIM2.3
N$17
  Top 0.305: IC6.4 7.62,29.96 6.99,30.6 6.99,32.5 TP5.TP
N$18
  Top 0.305: IC6.16 22.86,23.61 24.13,22.34 22.86,21.07 22.86,13.45 19.68,10.28 U2.7
N$19
  Top 0.305: IC6.20 17.14,28.69 15.88,29.96 15.88,35.04 TP6.TP
N$20
  Top 0.406: IC6.7 7.62,26.15 J10.1
  Bottom 0.406: R4.2 J10.1
N$21
  Top 0.406: U$1.P$9 52.07,14.09 TP8.TP
N$22
  Top 0.406: IC6.8 3.81,24.88 J11.1
  Bottom 0.406: R5.2 J11.1
N$23
  Top 0.406: IC6.9 3.81,23.61 J12.1
  Bottom 0.406: R6.2 J12.1
N$24
  Top 0.406: IC6.10 7.62,22.34 J13.1
  Bottom 0.406: J13.1 R7.2
N$25
  Top 0.406: U$1.P$10 54.61,15.36 TP9.TP
N$26
  Bottom 0.305: U$1.P$1 31.75,6.47 TP10.TP
N$27
  Bottom 0.305: Q1.1 39.49,8.89 TP11.TP
N$28
  Top 0.305: DRV1.P$17 TP12.TP
N$29
  Top 0.305: DRV2.P$17 48.9,35.68 46.99,37.58 44.45,37.58 TP13.TP
N$30
  Top 0.305: C2.1 11.28,48.38 R8.2 | Q3.3 16.51,48.84 16.51,50.92 16.23,51.2 IC3.15 13.62,51.2 11.43,49.01 R8.2 | R8.2 11.43,48.38
N$31
  Top 0.305: C1.1 11.28,45.84 R8.1 11.79,45.32 Q3.1 14.72,45.32 15.88,46.47 15.88,49.48 IC3.16
N$37
  Top 0.305: TP15.TP 7.62,56.63 7.62,54.09 8.89,52.82 IC4.2 12.7,52.82 13.03,52.5 IC3.13
N$38
  Top 0.305: IC4.6 2.54,54.09 J5.3
N$39
  Top 0.305: IC4.8 3.81,51.55 J5.1
N$40
  Top 0.305: IC4.7 2.54,52.82 J5.2
N$41
  Top 0.305: IC4.5 3.81,55.36 J5.4
N$43
  Top 0.406: IC2.7 2.54,40.12 J6.1
N$44
  Top 0.406: IC2.8 2.54,38.85 J6.2
PPS
  Top 0.305: J1.11 21.59,40.12 IC2.2
SCL
  Top 0.406: IC3.5 23.8,53.15 J1.5
SCLK
  Top 0.305: U$1.P$5 41.91,16.63 43.18,17.9 43.18,24.88 | 43.18,24.88 43.18,28.06 45.09,29.96 TP1.TP 45.09,32.5 DRV2.P$6 | IC6.1 13.97,33.77 15.24,32.5 15.24,29.33 17.78,26.79 23.5,26.79 | 23.5,26.79 J1.23 | 23.5,26.79 23.5,25.52 24.13,24.88 43.18,24.88
  Bottom 0.305: DRV1.P$6 44.45,48.38 44.45,41.39 45.72,40.12 DRV2.P$6
SDA
  Top 0.406: IC3.6 25.11,53.8 J1.3
SERINT
  Top 0.406: J1.7 TP7.TP 18.41,49.01 17.78,49.65 17.78,53.46 18.77,54.45 19.05,54.45 | IC3.7 19.05,54.45 | R1.2 18.26,55.23 19.05,54.45
STEP1
  Bottom 0.305: DRV1.P$2 36.83,48.38 36.83,42.03 39.37,39.49 39.37,31.23 40.64,29.96 43.18,29.96 44.45,28.69 52.7,28.69 U$1.P$11
STEP2
  Bottom 0.305: U$1.P$15 43.81,26.79 41.91,28.69 39.37,28.69 35.56,32.5 DRV2.P$2
V+
  Top 0.61: U2.2 U2.1
  Top 1.016: U2.1 12.62,2.58 J4.2
  Bottom 1.016: J4.2 IC1.1 10.29,6.47 C20.1 C19.1 C18.1
VMOT  (via drill 0.9)
  Top 0.61: U2.3 U2.4
  Top 1.016: U2.4 22.23,3.93 24.77,6.47 28.57,6.47 29.84,5.2 29.84,2.66 31.11,1.39 55.24,1.39 56.52,2.66 56.52,30.6 v54.61,32.5
  Bottom 1.016: v54.61,32.5 52.7,34.41 52.7,45.84 | 52.7,45.84 52.7,60.44 DRV1.P$9 | DRV2.P$9 52.7,45.84